# Altium schematic sheet Device_F2.SchDoc
size A3; Organization: Altium Limited; Address1: L3, 12a Rodborough Rd; Address2: Frenchs Forest; Address3: NSW; Address4: Australia 2086
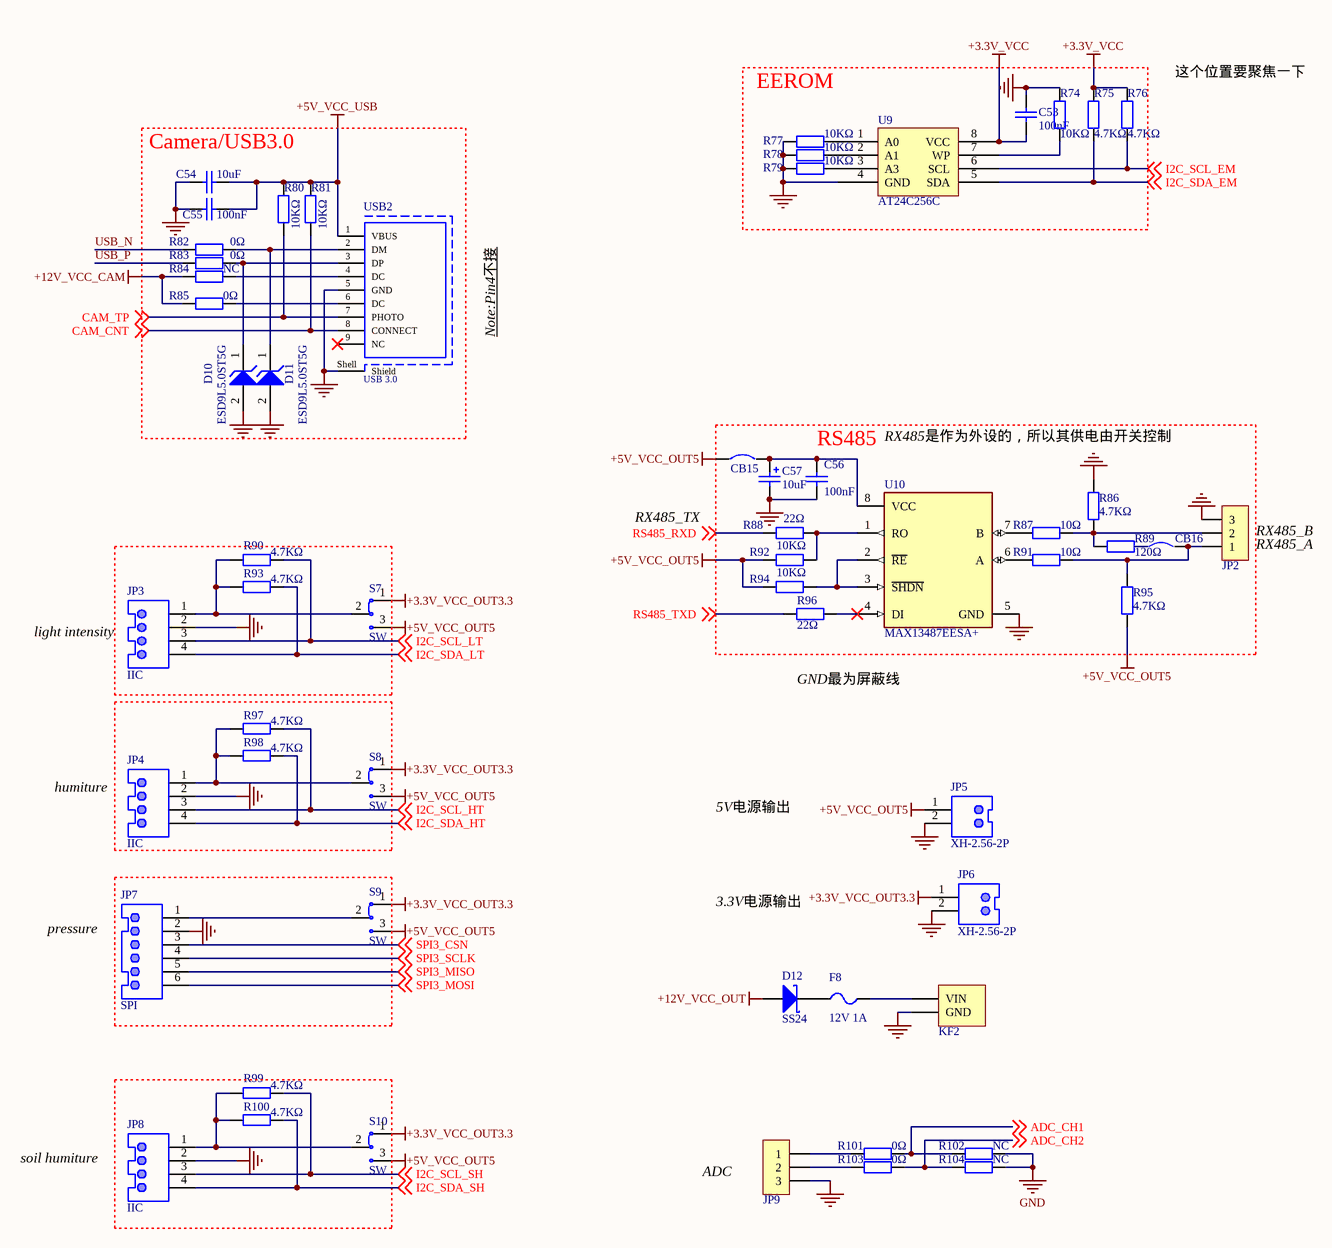
[diagram p0: Device_F2.SchDoc]

## Parts
C53  100nF  [0402_C]
C54  10uF  [0805_C]
C55  100nF  [0603_C]
C56  100nF  [0603_C]
C57  10uF  [CASE-A_3216]
CB15  CB  [CW]  (value not drawn)  (no BOM)
CB16  CB  [CW]  (value not drawn)  (no BOM)
D10  ESD9L5.0ST5G  [ONSC-SOD-923-2-514AB-01_V]
D11  ESD9L5.0ST5G  [ONSC-SOD-923-2-514AB-01_V]
D12  SS24  [SMA(DO-214AC)_S1]
F8  12V 1A  [FU 0805]
JP2  HDR-1X3  [XH2.54-3P]  (value not drawn)
JP3  IIC  [XH2.54-4P]
JP4  IIC  [XH2.54-4P]
JP5  XH-2.56-2P  [XH2.54-2P]
JP6  XH-2.56-2P  [XH2.54-2P]
JP7  SPI  [XH2.54-6P]
JP8  IIC  [XH2.54-4P]
JP9  HDR-1X3  [HDR-1X3]  (value not drawn)
KF2  DC  [KF2EDGK-2.54-LI-2P]  (value not drawn)
R74  10KΩ  [0402_R]
R75  4.7KΩ  [0402_R]
R76  4.7KΩ  [0402_R]
R77  10KΩ  [0402_R]
R78  10KΩ  [0402_R]
R79  10KΩ  [0402_R]
R80  10KΩ  [0402_R]
R81  10KΩ  [0402_R]
R82  0Ω  [0402_R]
R83  0Ω  [0402_R]
R84  NC  [0603_R]
R85  0Ω  [0603_R]
R86  4.7KΩ  [0603_R]
R87  10Ω  [0603_R]
R88  22Ω  [0603_R]
R89  120Ω  [0402_R]
R90  4.7KΩ  [0402_R]
R91  10Ω  [0603_R]
R92  10KΩ  [0603_R]
R93  4.7KΩ  [0402_R]
R94  10KΩ  [0603_R]
R95  4.7KΩ  [0603_R]
R96  22Ω  [0603_R]
R97  4.7KΩ  [0402_R]
R98  4.7KΩ  [0402_R]
R99  4.7KΩ  [0402_R]
R100  4.7KΩ  [0402_R]
R101  0Ω  [0402_R]
R102  NC  [0402_R]
R103  0Ω  [0402_R]
R104  NC  [0402_R]
S7  SW  [SWITCH_SPOT]
S8  SW  [SWITCH_SPOT]
S9  SW  [SWITCH_SPOT]
S10  SW  [SWITCH_SPOT]
U9  AT24C256C  [SOIC-8_150mil]
U10  MAX13487EESA+  [FP-S8-2-IPC_A]
USB2  USB 3.0  [USB3.0-i]

## Blocks framed on the sheet
EEROM: C53 R74-R79 U9
Camera/USB3.0: C54 C55 D10 D11 R80-R85 USB2
RS485: C56 C57 CB15 CB16 JP2 R86-R89 R91 R92 R94-R96 U10

## Nets
+3.3V_VCC: C53.1 R75.1 R76.1 U9.8(VCC)
+3.3V_VCC_OUT3.3: JP6.1 S7.1 S8.1 S9.1 S10.1
+5V_VCC_OUT5: CB15.1 JP5.1 R92.1 R94.1 R95.1 S7.3 S8.3 S9.3 S10.3
+5V_VCC_USB: C54.2 C55.2 R80.2 R81.2 USB2.1(VBUS)
+12V_VCC_CAM: R84.1 R85.1
+12V_VCC_OUT: D12.1(A)
GND: C53.2 C54.1 C55.1 C56.1 C57.2 D10.2(A) D11.2(A) JP2.3 JP3.2 JP4.2 JP5.2 JP6.2 JP7.2 JP8.2 JP9.3 KF2.2(GND) R74.1 R77.2 R78.2 R79.2 R86.2 R102.2 R104.2 U9.4(GND) U10.5(GND) USB2.5(GND) USB2.Shell(Shield)
ADC_CH1: R101.2 R102.1 ; off-sheet ADC_CH1
ADC_CH2: R103.2 R104.1 ; off-sheet ADC_CH2
CAM_CNT: R81.1 USB2.8(CONNECT) ; off-sheet CAM_CNT
CAM_TP: R80.1 USB2.7(PHOTO) ; off-sheet CAM_TP
I2C_SCL_EM: R76.2 U9.6(SCL) ; off-sheet I2C_SCL_EM
I2C_SCL_HT: JP4.3 R97.2 ; off-sheet I2C_SCL_HT
I2C_SCL_LT: JP3.3 R90.2 ; off-sheet I2C_SCL_LT
I2C_SCL_SH: JP8.3 R99.2 ; off-sheet I2C_SCL_SH
I2C_SDA_EM: R75.2 U9.5(SDA) ; off-sheet I2C_SDA_EM
I2C_SDA_HT: JP4.4 R98.2 ; off-sheet I2C_SDA_HT
I2C_SDA_LT: JP3.4 R93.2 ; off-sheet I2C_SDA_LT
I2C_SDA_SH: JP8.4 R100.2 ; off-sheet I2C_SDA_SH
RS485_RXD: R88.1 ; off-sheet RS485_RXD
RS485_TXD: R96.1 ; off-sheet RS485_TXD
SPI3_CSN: JP7.3 ; off-sheet SPI3_CSN
SPI3_MISO: JP7.5 ; off-sheet SPI3_MISO
SPI3_MOSI: JP7.6 ; off-sheet SPI3_MOSI
SPI3_SCLK: JP7.4 ; off-sheet SPI3_SCLK
USB_N: R82.1
USB_P: R83.1
NetC56_2: C56.2 C57.1 CB15.2 U10.8(VCC)
NetCB16_1: CB16.1 R89.1
NetCB16_2: CB16.2 JP2.1 R91.2 R95.2
NetD10_1: D10.1(K) R83.2 USB2.3(DP)
NetD11_1: D11.1(K) R82.2 USB2.2(DM)
NetD12_2: D12.2(K) F8.2
NetF8_1: F8.1 KF2.1(VIN)
NetJP2_2: JP2.2 R86.1 R87.2 R89.2
NetJP3_1: JP3.1 R90.1 R93.1 S7.2
NetJP4_1: JP4.1 R97.1 R98.1 S8.2
NetJP7_1: JP7.1 S9.2
NetJP8_1: JP8.1 R99.1 R100.1 S10.2
NetJP9_1: JP9.1 R101.1
NetJP9_2: JP9.2 R103.1
NetR74_2: R74.2 U9.7(WP)
NetR77_1: R77.1 U9.1(A0)
NetR78_1: R78.1 U9.2(A1)
NetR79_1: R79.1 U9.3(A3)
NetR84_2: R84.2 USB2.4(DC)
NetR85_2: R85.2 USB2.6(DC)
NetR87_1: R87.1 U10.7(B)
NetR88_2: R88.2 R92.2 U10.1(RO)
NetR91_1: R91.1 U10.6(A)
NetR94_2: R94.2 U10.2(~{RE}) U10.3(~{SHDN})
NetR96_2: R96.2 U10.4(DI)

Not connected (* = marked no-connect by the designer): USB2 9(NC)*

## Notes on the sheet
- (near R76) 这个位置要聚焦一下
- Note:Pin4不接
- RX485是作为外设的，所以其供电由开关控制
- RX485_TX
- (near JP2) RX485_B
- (near JP2) RX485_A
- (near JP3) light intensity
- GND最为屏蔽线
- humiture
- 5V电源输出
- pressure
- 3.3V电源输出
- (near JP8) soil humiture
- ADC
- Title
- Size:
- Date:
- A3
- Number:
- Time:
- Revision:
- Sheet
- of
- File:
- *

## Library data of the parts
C53 = Cap 0402 100nF (104) 10% 16V: 贴片电容; ComponentLink1Description: 供应商链接; ComponentLink1URL: http://www.szlcsc.com/product/details_1877.html; Package: 0402; Supplier: LC; SuppliersPartNumber: C1525
C54 = Cap 0805 10uF (106) 10% 25V: 贴片电容; ComponentLink1Description: 供应商链接; ComponentLink1URL: http://www.szlcsc.com/product/details_16532.html; Package: 0805; Supplier: LC; SuppliersPartNumber: C15850; Value: 10uF
C55 C56 = Cap 0603 100nF (104) 10% 50V: 贴片电容; ComponentLink1Description: 供应商链接; ComponentLink1URL: http://www.szlcsc.com/product/details_15331.html; Package: 0603; Supplier: LC; SuppliersPartNumber: C14663
C57 = Cap 3216 10uF (106) 10% 16V: 钽电容; ComponentLink1Description: 供应商链接; ComponentLink1URL: http://www.szlcsc.com/product/details_7643.html; Package: 3216; Supplier: LC; SuppliersPartNumber: C7171
CB15 CB16 = Circuit Breaker: Published: 24-Mar-1999; LatestRevisionDate: 17-Jul-2002; LatestRevisionNote: Re-released for DXP Platform.; PackageReference: SPST-2; Publisher: Altium Limited
D10 D11 = SOD-923 ESD9L5.0ST5G: Transient Voltage Suppressor, ESD Protection Diode with Ultra-Low Capacitance, 2-Pin SOD-923, Pb-Free, Tape and Reel, CMP-1063-00114-1; Manufacturer: On Semiconductor; IR Max (uA): 1; VRWM Max (V): 5; V(BR) Min (V): 5.4; C Max (pF): 0.9; Direction: Unidirectional; RoHS: Pb-Free; Packing: Tape and Reel; Mounting Technology: Surface Mount; ComponentLink3Description: Package Specification; PackageDescription: 2-Pin SOD, Body 0.8 x 0.6 mm; ComponentLink2Description: Datasheet; PackageReference: SOD-923-2-514AB-01; PartNumber: ESD9L5.0ST5G; ComponentLink1Description: Manufacturer URL; PackageVersion: Rev. C, 03/2011; Number of Lines: 1; ComponentLink3URL: http://www.onsemi.com/pub_link/Collateral/514AB.PDF; DatasheetVersion: Rev. 5; ComponentLink2URL: http://www.onsemi.cn/pub_link/Collateral/ESD9L-D.PDF; ComponentLink1URL: http://www.onsemi.com/
D12 = SMA(DO-214AC) SS24: 肖特基二极管; ComponentLink1Description: 供应商链接; ComponentLink1URL: http://www.szlcsc.com/product/details_23178.html; Package: SMA(DO-214AC); Supplier: LC; SuppliersPartNumber: C22452
F8 = FU PPTC MSMD 12V 1A: 自恢复保险丝; BOM名称: 贴片保险丝; 版权归属: 源创客; 学习资源: www.ooocke.com
JP2 JP9 = Header HDR-1X3: 3P接插件; 版权归属: 源创客; BOM名称: 3P接插件; 学习资源: www.ooocke.com
JP3 JP4 JP8 = Header XH-2.56-4P: Male Header, Pitch 2.5 mm, 1 x 4 Position, Height 7 mm, Tail Length 8.4 mm, -25 to 85 degC, RoHS, Bulk; Manufacturer: JST; No of Positions: 2; Pitch: 2.5mm; Style/Orientation: StraightHeader/Plug; Datasheet Version: 05/2016; Package Description: Male Header, Pitch 2.5 mm, 1 x 2 Position, Height 7 mm, Tail Length 3.4 mm; Package Reference: B2B-XH-A; Mounting Technology: ThroughHole; Type: ShroudedHeader; Datasheet URL: http://www.jst-mfg.com/product/pdf/eng/eXH.pdf; Manufacturer URL: http://www.jst.com/home2.html; Termination: Crimp
JP5 JP6 = Header XH-2.56-2P: Male Header, Pitch 2.5 mm, 1 x 2 Position, Height 7 mm, Tail Length 3.4 mm, -25 to 85 degC, RoHS, Bulk; Manufacturer: JST; No of Positions: 2; Pitch: 2.5mm; Style/Orientation: StraightHeader/Plug; Datasheet Version: 05/2016; Package Description: Male Header, Pitch 2.5 mm, 1 x 2 Position, Height 7 mm, Tail Length 3.4 mm; Package Reference: B2B-XH-A; Mounting Technology: ThroughHole; Type: ShroudedHeader; Datasheet URL: http://www.jst-mfg.com/product/pdf/eng/eXH.pdf; Manufacturer URL: http://www.jst.com/home2.html; Termination: Crimp
JP7 = Header XH-2.56-6P: Male Header, Pitch 2.5 mm, 1 x 4 Position, Height 7 mm, Tail Length 8.4 mm, -25 to 85 degC, RoHS, Bulk; Manufacturer: JST; No of Positions: 2; Pitch: 2.5mm; Style/Orientation: StraightHeader/Plug; Datasheet Version: 05/2016; Package Description: Male Header, Pitch 2.5 mm, 1 x 2 Position, Height 7 mm, Tail Length 3.4 mm; Package Reference: B2B-XH-A; Mounting Technology: ThroughHole; Type: ShroudedHeader; Datasheet URL: http://www.jst-mfg.com/product/pdf/eng/eXH.pdf; Manufacturer URL: http://www.jst.com/home2.html; Termination: Crimp
KF2 = KF2EDGK-2.54-2P: 2P, DC,KF2EDGK-2.54
R74 R77-R81 = Res 0402 10KΩ (1002) 1%: 贴片电阻; ComponentLink1Description: 供应商链接; ComponentLink1URL: http://www.szlcsc.com/product/details_26487.html; Package: 0402; Supplier: LC; SuppliersPartNumber: C25744; Value: 10KΩ
R75 R76 R90 R93 R97-R100 = Res 0402 4.7KΩ (4701) 1%: 贴片电阻; ComponentLink1Description: 供应商链接; ComponentLink1URL: http://www.szlcsc.com/product/details_26643.html; Package: 0402; Supplier: LC; SuppliersPartNumber: C25900; Value: 4.7KΩ
R82 R83 R101 R103 = Res 0402 0Ω (0R0) 1%: 贴片电阻; ComponentLink1Description: 供应商链接; ComponentLink1URL: http://www.szlcsc.com/product/details_17853.html; Package: 0402; Supplier: LC; SuppliersPartNumber: C17168; Value: 0Ω
R84 R85 = Res 0603 0Ω (0R0) 1%: 贴片电阻; ComponentLink1Description: 供应商链接; ComponentLink1URL: http://www.szlcsc.com/product/details_21903.html; Package: 0603; Supplier: LC; SuppliersPartNumber: C21189
R86 R95 = Res 0603 4.7KΩ (4701) 1%: 贴片电阻; ComponentLink1Description: 供应商链接; ComponentLink1URL: http://www.szlcsc.com/product/details_23889.html; Package: 0603; Supplier: LC; SuppliersPartNumber: C23162
R87 R91 = Res 0603 10Ω (10R0) 1%: 贴片电阻; ComponentLink1Description: 供应商链接; ComponentLink1URL: http://www.szlcsc.com/product/details_23586.html; Package: 0603; Supplier: LC; SuppliersPartNumber: C22859
R88 R96 = Res 0603 22Ω (22R0) 1%: 贴片电阻; ComponentLink1Description: 供应商链接; ComponentLink1URL: http://www.szlcsc.com/product/details_24078.html; Package: 0603; Supplier: LC; SuppliersPartNumber: C23345
R89 = Res 0402 120Ω (1200) 1%: 贴片电阻; ComponentLink1Description: 供应商链接; ComponentLink1URL: http://www.szlcsc.com/product/details_25822.html; Package: 0402; Supplier: LC; SuppliersPartNumber: C25079
R92 R94 = Res 0603 10KΩ (1002) 1%: 贴片电阻; ComponentLink1Description: 供应商链接; ComponentLink1URL: http://www.szlcsc.com/product/details_26547.html; Package: 0603; Supplier: LC; SuppliersPartNumber: C25804
R102 R104 = Res 0402 0Ω (0R0) 1%: 贴片电阻; Value: 0Ω; ComponentLink1Description: 供应商链接; ComponentLink1URL: http://www.szlcsc.com/product/details_17853.html; Package: 0402; Supplier: LC; SuppliersPartNumber: C17168
S7-S10 = SW SPOT_SW-1P: 1路开关; BOM名称: 波动开关; 版权归属: 源创客; 学习资源: www.ooocke.com
U9 = EEPROM/AT24C256C-SSHL-T_[C6482]: EEPROM; ComponentLink1Description: 供应商链接; ComponentLink1URL: http://www.szlcsc.com/product/details_6947.html; Package: SOIC-8_150mil; Supplier: LC; SuppliersPartNumber: C6482
U10 = MAX13487: IC TXRX RS485/422 8-SOIC; Manufacturer: Maxim Integrated; Number Of Receivers: 1; Simplex Duplex: Half Duplex; Interface: RS-485,RS-422; Min Supply Voltage: 4.75V; Standoff Height: 0.1mm; Max Junction Temp: +150°C; Nominal Supply Current: 4.5mA; Data Rate: 500kbits/s; Max Supply Voltage: 5.25V; Category: IC; Temperature Range Low: -40°C; Automotive: No; Device Class L1: Integrated Circuits (ICs); Digikey Description: IC TXRX RS485/422 8-SOIC; Octopart: https://octopart.com/max13487eesa%2B-maxim+integrated-42201144; Lead Free: Yes; Device Class L3: RS-232 / RS-422 / RS-485 Interface ICs; Footprint Url: https://pdfserv.maximintegrated.com/land_patterns/90-0096.PDF; Mouser Description: MAX13487 Series 500 kbps 5.25 V Half-Duplex SMT RS 485/422 Transceiver - SOIC-8; Temperature Range High: +85°C; Temperature: -40°C to +85°C; Number Of Transmitters: 1; ComponentLink2Description: Datasheet; RoHS: TRUE; Device Class L2: Interface ICs; Manufacturer Part Number: MAX13487EESA+; Height: 1.75mm; Package: S8-2; ComponentLink2URL: https://datasheets.maximintegrated.com/en/ds/MAX13487E-MAX13488E.pdf
USB2 = USB 3.0 Type A: USB 3.0 Type A Receptacle WR-COM, Horizontal, THT; Part Number: 692121030100; Manufacturer: Wurth Elektronik; Contact Resistance: 50mOhm; Working Voltage: 30VAC; Rated Current: 0.25A; Orientation: Horizontal; Publisher: WurthElektronik; Gender: Receptacle; Mounting Technology: THT; Datasheet URL: https://katalog.we-online.de/em/datasheet/692121030100.pdf; Package Reference: 692121030100; Operating Temperature: -20to85degC; Packaging: TapeandReel; Manufacturer URL: http://www.we-online.de; Connector Type: USB3.0TypeA